# EAGLE design MSXIoT_bus (EAGLE 9.6.2)
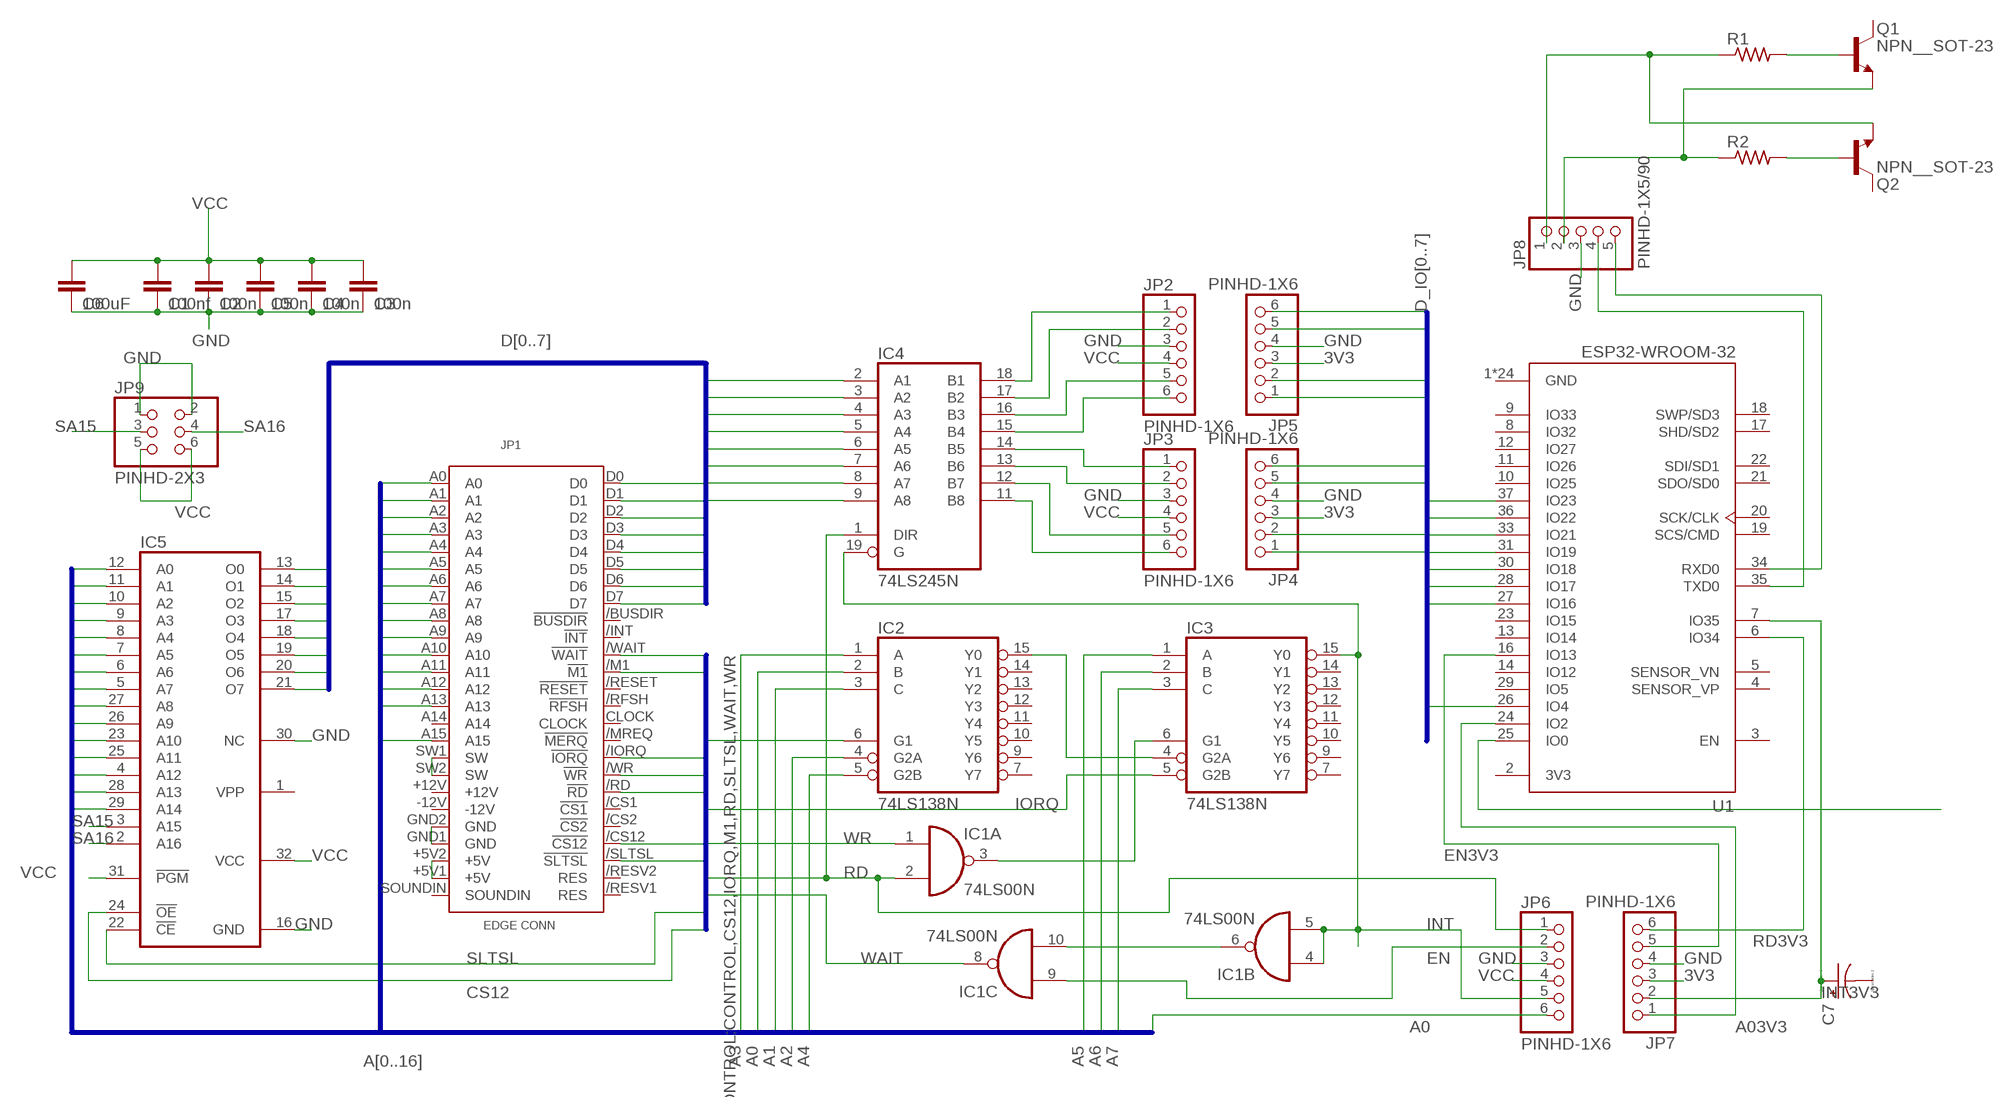
[diagram p0: schematic, sheet 1]

## Parts
C1  100nf  C2.5/2  [C2.5-2]
C2  100n  C2,5-3  [C2.5-3]
C3  100n  C2,5-3  [C2.5-3]
C4  100n  C2,5-3  [C2.5-3]
C5  100n  C2,5-3  [C2.5-3]
C6  100uF  C2.5/6  [C2.5-6]
C7  CPOL-US153CLV-0505  [153CLV-0505]
IC1  74LS00N  [DIL14]
IC2  74LS138N  [DIL16]
IC3  74LS138N  [DIL16]
IC4  74LS245N  [DIL20]
IC5  27C1001A  [DIL32]
JP1  MSXCART  [MSXCART]
JP2  PINHD-1X6  [1X06]
JP3  PINHD-1X6  [1X06]
JP4  PINHD-1X6  [1X06]
JP5  PINHD-1X6  [1X06]
JP6  PINHD-1X6  [1X06]
JP7  PINHD-1X6  [1X06]
JP8  PINHD-1X5/90  [1X05/90]
JP9  PINHD-2X3  [2X03]
Q1  NPN__SOT-23  [SOT95P237X112-3N]
Q2  NPN__SOT-23  [SOT95P237X112-3N]
R1  R-US_0204/5  [0204/5]
R2  R-US_0204/5  [0204/5]
U1  ESP32-WROOM-32  [MODULE_ESP32-WROOM-32]

## Nets
3V3: JP4.3 JP5.3 JP7.3
A0: IC2.2(B) IC5.12(A0) JP1.A0 JP6.6
A1: IC2.3(C) IC5.11(A1) JP1.A1
A2: IC2.4(G2A) IC5.10(A2) JP1.A2
A3: IC2.1(A) IC5.9(A3) JP1.A3
A03V3: JP7.1 U1.24(IO2)
A4: IC2.5(G2B) IC5.8(A4) JP1.A4
A5: IC3.1(A) IC5.7(A5) JP1.A5
A6: IC3.2(B) IC5.6(A6) JP1.A6
A7: IC3.3(C) IC5.5(A7) JP1.A7
A8: IC5.27(A8) JP1.A8
A9: IC5.26(A9) JP1.A9
A10: IC5.23(A10) JP1.A10
A11: IC5.25(A11) JP1.A11
A12: IC5.4(A12) JP1.A12
A13: IC5.28(A13) JP1.A13
A14: IC5.29(A14) JP1.A15
CS12: IC5.24(!OE) JP1./CS12(!CS12)
D0: IC4.2(A1) IC5.13(O0) JP1.D0
D1: IC4.3(A2) IC5.14(O1) JP1.D1
D2: IC4.4(A3) IC5.15(O2) JP1.D2
D3: IC4.5(A4) IC5.17(O3) JP1.D3
D4: IC4.6(A5) IC5.18(O4) JP1.D4
D5: IC4.7(A6) IC5.19(O5) JP1.D5
D6: IC4.8(A7) IC5.20(O6) JP1.D6
D7: IC4.9(A8) IC5.21(O7) JP1.D7
D_IO0: JP5.6 U1.37(IO23)
D_IO1: JP5.5 U1.36(IO22)
D_IO2: JP5.2 U1.33(IO21)
D_IO3: JP5.1 U1.31(IO19)
D_IO4: JP4.6 U1.30(IO18)
D_IO5: JP4.5 U1.28(IO17)
D_IO6: JP4.2 U1.27(IO16)
D_IO7: JP4.1 U1.26(IO4)
EN: IC1.9(C:I0) JP6.2
EN3V3: JP7.5 U1.16(IO13)
GND: C1.2 C2.2 C3.2 C4.2 C5.2 C6.2 IC5.16(GND) IC5.30(NC) JP1.GND1(GND) JP1.GND2(GND) JP2.3 JP3.3 JP4.4 JP5.4 JP6.3 JP7.4 JP8.3 JP9.1 JP9.2
INT: IC1.4(B:I0) IC1.5(B:I1) IC3.15(Y0) IC4.19(G) JP6.5
INT3V3: C7.+ JP7.2 U1.7(IO35)
IORQ: IC3.5(G2B) JP1./IORQ(!IORQ)
M1: IC2.6(G1) JP1./M1(!M1)
N$1: IC1.6(B:O) IC1.10(C:I1)
N$2: IC4.18(B1) JP2.1
N$3: IC2.15(Y0) IC3.4(G2A)
N$4: IC1.3(A:O) IC3.6(G1)
N$5: IC4.17(B2) JP2.2
N$6: IC4.16(B3) JP2.5
N$7: IC4.15(B4) JP2.6
N$8: IC4.14(B5) JP3.1
N$9: IC4.13(B6) JP3.2
N$10: IC4.12(B7) JP3.5
N$11: IC4.11(B8) JP3.6
N$12: JP1.SW1(SW) JP1.SW2(SW)
N$13: JP8.4 U1.35(TXD0)
N$14: JP8.5 U1.34(RXD0)
N$15: U1.25(IO0)
N$16: JP8.1 Q2.1(E) R1.1
N$17: Q1.2(B) R1.2
N$18: Q2.2(B) R2.2
N$19: JP8.2 Q1.1(E) R2.1
RD: IC1.2(A:I1) IC4.1(DIR) JP1./RD(!RD) JP6.1
RD3V3: JP7.6 U1.6(IO34)
SA15: IC5.3(A15) JP9.3
SA16: IC5.2(A16) JP9.4
SLTSL: IC5.22(!CE) JP1./SLTSL(!SLTSL)
VCC: C1.1 C2.1 C3.1 C4.1 C5.1 C6.1 IC5.31(!PGM) IC5.32(VCC) JP1.+5V1(+5V) JP1.+5V2(+5V) JP2.4 JP3.4 JP6.4 JP9.5 JP9.6
WAIT: IC1.8(C:O) JP1./WAIT(!WAIT)
WR: IC1.1(A:I0) JP1./WR(!WR)
Unconnected: C7.- IC1.11(D:O) IC1.12(D:I0) IC1.13(D:I1) IC2.7(Y7) IC2.9(Y6) IC2.10(Y5) IC2.11(Y4) IC2.12(Y3) IC2.13(Y2) IC2.14(Y1) IC3.7(Y7) IC3.9(Y6) IC3.10(Y5) IC3.11(Y4) IC3.12(Y3) IC3.13(Y2) IC3.14(Y1) IC5.1(VPP) JP1.+12V JP1.-12V JP1./BUSDIR(!BUSDIR) JP1./CS1(!CS1) JP1./CS2(!CS2) JP1./INT(!INT) JP1./MREQ(!MERQ) JP1./RESET(!RESET) JP1./RESV1(RES) JP1./RESV2(RES) JP1./RFSH(!RFSH) JP1.A14 JP1.CLOCK JP1.SOUNDIN Q1.3(C) Q2.3(C) U1.3(EN) U1.4(SENSOR_VP) U1.5(SENSOR_VN) U1.8(IO32) U1.9(IO33) U1.10(IO25) U1.11(IO26) U1.12(IO27) U1.13(IO14) U1.14(IO12) U1.17(SHD/SD2) U1.18(SWP/SD3) U1.19(SCS/CMD) U1.20(SCK/CLK) U1.21(SDO/SD0) U1.22(SDI/SD1) U1.23(IO15) U1.29(IO5)

## Buses
D[0..7]
A[0..16]
CONTROL:CONTROL,CS12,IORQ,M1,RD,SLTSL,WAIT,WR
D_IO[0..7]

## Power pins joined to a net without a drawn wire
3V3: U1.2(3V3)
GND: IC1.7(P:GND) IC2.8(GND) IC3.8(GND) IC4.10(GND) U1.1(GND) U1.15(GND) U1.38(GND) U1.39_1(GND) U1.39_2(GND) U1.39_3(GND) U1.39_4(GND) U1.39_5(GND) U1.39_6(GND) U1.39_7(GND) U1.39_8(GND) U1.39_9(GND) U1.39_10(GND) U1.39_11(GND) U1.39_12(GND) U1.39_13(GND) U1.39_14(GND) U1.39_15(GND) U1.39_16(GND) U1.39_17(GND) U1.39_18(GND) U1.39_19(GND) U1.39_20(GND) U1.39_21(GND)
VCC: IC1.14(P:VCC) IC2.16(VCC) IC3.16(VCC) IC4.20(VCC)

## Library data of the parts
C1-C6 = capacitor-wima:C: CAPACITOR naming: grid - package width
C7 = resistor:CPOL-US: POLARIZED CAPACITOR, American symbol
IC1 = 74xx-eu:74*00: Quad 2-input NAND gate
IC2 IC3 = 74xx-eu:74*138: 3-line to 8-line DECODER/DEMULTIPLEXER
IC4 = 74xx-us:74*245: Octal BUS TRANSCEIVER, 3-state
IC5 = memory-nec:27C1001A: MEMORY; MPN: M27C1001-15F1; OC_FARNELL: 1661756; OC_NEWARK: 78M7615
JP1 = msx-con:MSXCART
JP2-JP7 = Connector:PINHD-1X6: PIN HEADER; CATEGORY: CONNECTOR; SUB-CATEGORY: PIN-HEADER
JP8 = Connector:PINHD-1X5: PIN HEADER; CATEGORY: CONNECTOR; SUB-CATEGORY: PIN-HEADER
JP9 = Connector:PINHD-2X3: PIN HEADER; CATEGORY: CONNECTOR; SUB-CATEGORY: PIN-HEADER
Q1 Q2 = Transistor:NPN_: NPN - Popular parts; CATEGORY: Transistor; DESCRIPTION: TRANS NPN 40V 0.2A SOT23; MANUFACTURER: Nexperia USA Inc.; SUB-CATEGORY: BJT; TYPE: NPN
R1 R2 = resistor:R-US_: RESISTOR, American symbol
U1 = ESP32-WROOM-32:ESP32-WROOM-32: Bluetooth, WiFi Transceiver Module 2.4GHz ~ 2.5GHz Surface Mount; AVAILABILITY: Unavailable; DESCRIPTION: 802.11b/g/n, Bluetooth v4.2 +EDR, Class 1, 2 and 3 Transceiver Module 2.4GHz ~ 2.5GHz Integrated, Trace Surface Mount; MF: Espressif Systems; MP: ESP32-WROOM-32; PACKAGE: Module Espressif Systems; PRICE: None

## Board
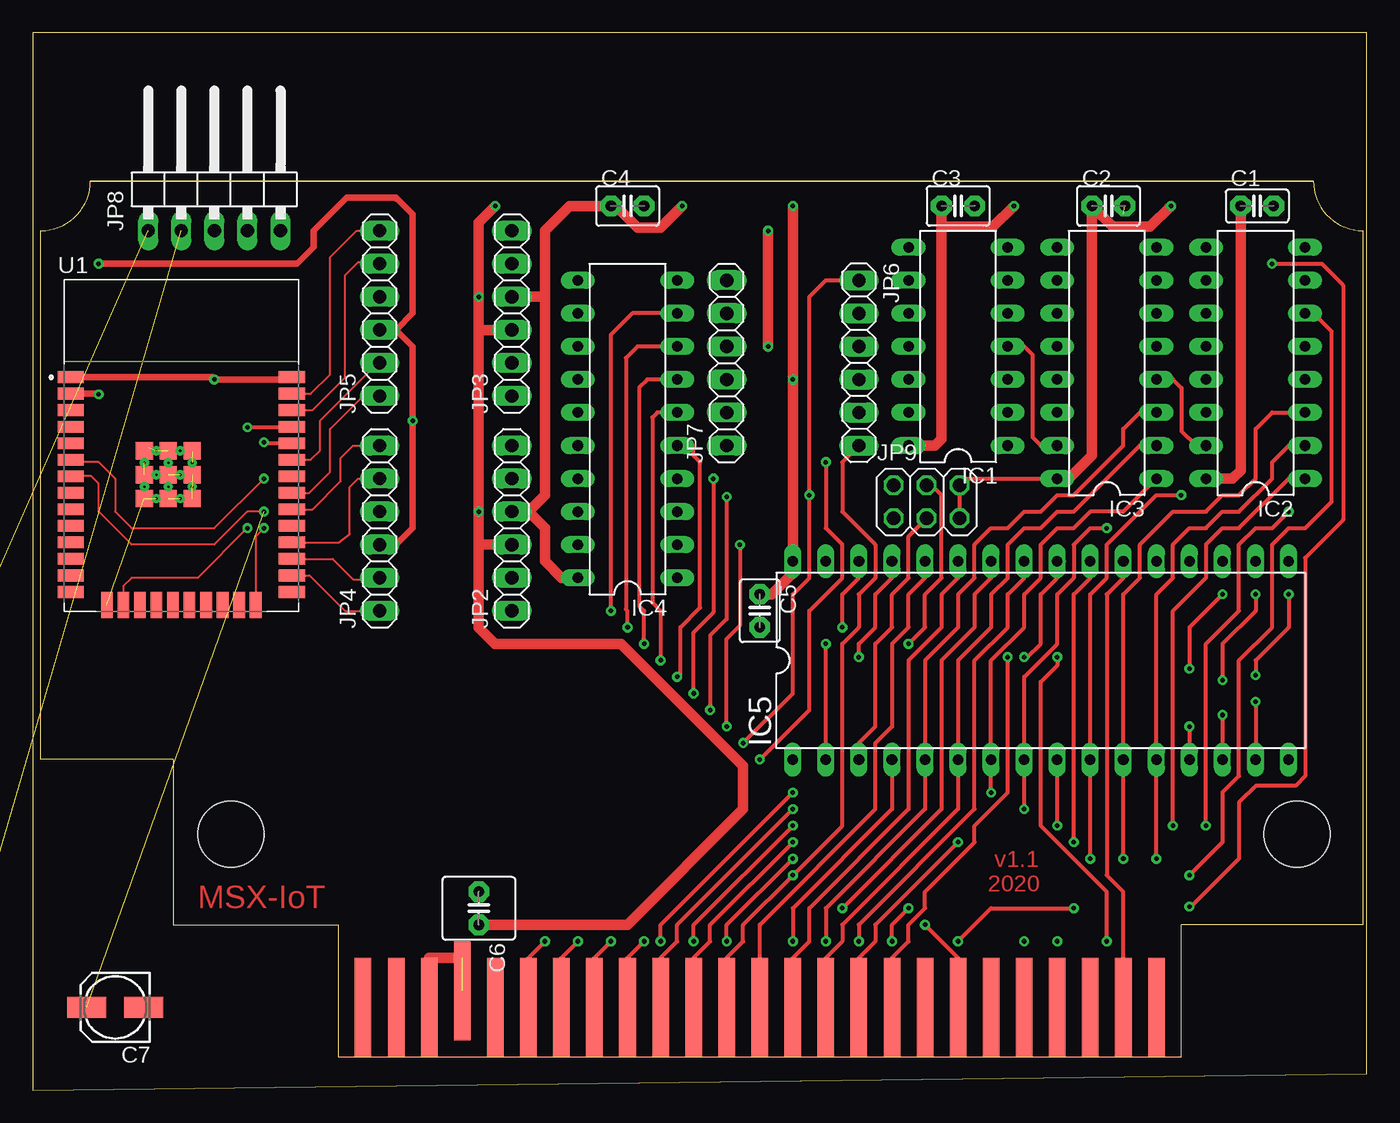
[diagram p1: board, top side]
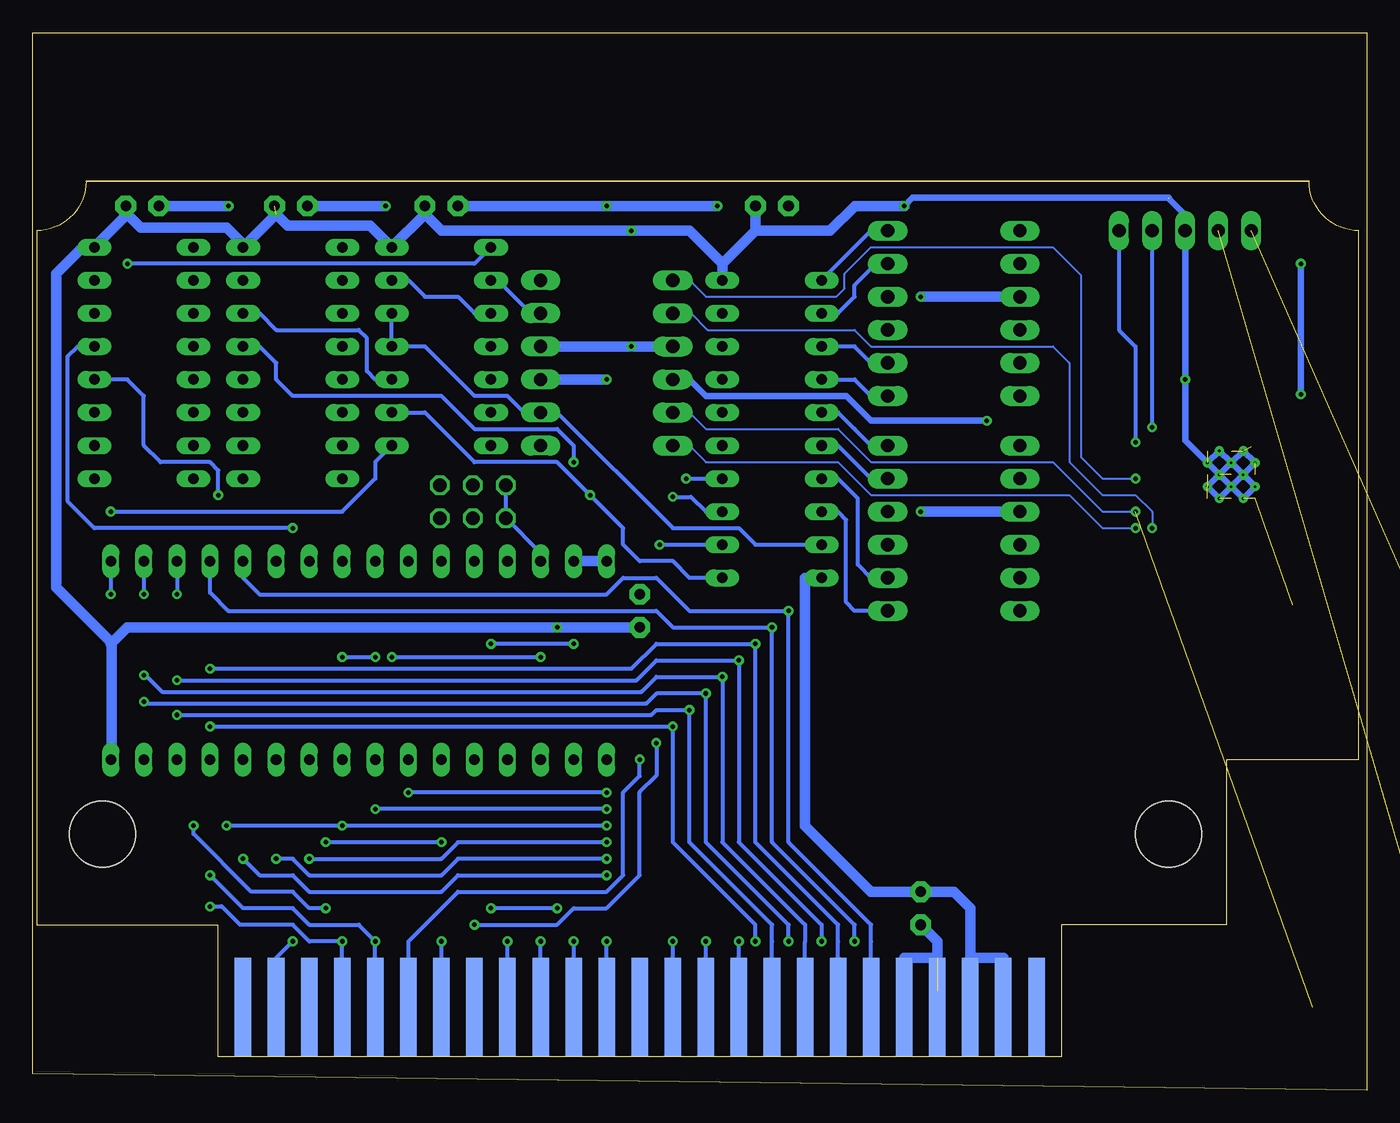
[diagram p2: board, bottom side, seen from below]

Size 102.54 x 81.27 mm. Coordinates in mm from the lower left corner, seen from the top.
Outline: 0,0 102.54,1.27 102.54,81.27 0,81.27 0,0
Copper layers (1*16): Top 0.035mm / dielectric 1.5mm / Bottom 0.035mm
Design rules "default": minimum track width 6mil, minimum drill 0.35mm, track to track 6mil, track to pad 6mil, pad to pad 6mil, via to via 6mil, smd to smd 6mil, copper to edge 40mil, drill to drill 6mil, minimum pad ring 10mil, minimum via ring 8mil, stop-mask expansion 4mil, vias tented up to drill 0mil, thermal gap 10mil

### Footprints (pad centres in the part's own frame; a part is rotated, then mirrored left to right if it is on the bottom)
C2.5-2 = drill 0.813 pad 1.6 octagon: 1 -1.27,0; 2 1.27,0
C2.5-3 = drill 0.813 pad 1.6 octagon: 1 -1.27,0; 2 1.27,0
C2.5-6 = drill 0.813 pad 1.6 octagon: 1 -1.27,0; 2 1.27,0
153CLV-0505 = smd 3 x 1.6: + 2.2,0; - -2.2,0
DIL14 = drill 0.813 long: 1 -7.62,-3.81; 2 -5.08,-3.81; 3 -2.54,-3.81; 4 0,-3.81; 5 2.54,-3.81; 6 5.08,-3.81; 7 7.62,-3.81; 8 7.62,3.81; 9 5.08,3.81; 10 2.54,3.81; 11 0,3.81; 12 -2.54,3.81; 13 -5.08,3.81; 14 -7.62,3.81
DIL16 = drill 0.813 long: 1 -8.89,-3.81; 2 -6.35,-3.81; 3 -3.81,-3.81; 4 -1.27,-3.81; 5 1.27,-3.81; 6 3.81,-3.81; 7 6.35,-3.81; 8 8.89,-3.81; 9 8.89,3.81; 10 6.35,3.81; 11 3.81,3.81; 12 1.27,3.81; 13 -1.27,3.81; 14 -3.81,3.81; 15 -6.35,3.81; 16 -8.89,3.81
DIL20 = drill 0.813 long: 1 -11.43,-3.81; 2 -8.89,-3.81; 3 -6.35,-3.81; 4 -3.81,-3.81; 5 -1.27,-3.81; 6 1.27,-3.81; 7 3.81,-3.81; 8 6.35,-3.81; 9 8.89,-3.81; 10 11.43,-3.81; 11 11.43,3.81; 12 8.89,3.81; 13 6.35,3.81; 14 3.81,3.81; 15 1.27,3.81; 16 -1.27,3.81; 17 -3.81,3.81; 18 -6.35,3.81; 19 -8.89,3.81; 20 -11.43,3.81
DIL32 = drill 0.813 long: 1 -19.05,-7.62; 2 -16.51,-7.62; 3 -13.97,-7.62; 4 -11.43,-7.62; 5 -8.89,-7.62; 6 -6.35,-7.62; 7 -3.81,-7.62; 8 -1.27,-7.62; 9 1.27,-7.62; 10 3.81,-7.62; 11 6.35,-7.62; 12 8.89,-7.62; 13 11.43,-7.62; 14 13.97,-7.62; 15 16.51,-7.62; 16 19.05,-7.62; 17 19.05,7.62; 18 16.51,7.62; 19 13.97,7.62; 20 11.43,7.62; 21 8.89,7.62; 22 6.35,7.62; 23 3.81,7.62; 24 1.27,7.62; 25 -1.27,7.62; 26 -3.81,7.62; 27 -6.35,7.62; 28 -8.89,7.62; 29 -11.43,7.62; 30 -13.97,7.62; 31 -16.51,7.62; 32 -19.05,7.62
MSXCART = smd 1.27 x 7.62 bottom: +5V1 -24.13,-36.83; +5V2 -21.59,-36.83; /CS1 34.29,-36.83; /CS12 31.75,-36.83; /IORQ 21.59,-36.83; /M1 24.13,-36.83; /RESET 16.51,-36.83; /RESV2 29.21,-36.83; /WAIT 26.67,-36.83; /WR 19.05,-36.83; A1 1.27,-36.83; A3 -1.27,-36.83; A5 -3.81,-36.83; A7 8.89,-36.83; A9 13.97,-36.83; A11 11.43,-36.83; A12 6.35,-36.83; A14 3.81,-36.83; D1 -6.35,-36.83; D3 -8.89,-36.83; D5 -11.43,-36.83; D7 -13.97,-36.83; GND1 -19.05,-36.83; GND2 -16.51,-36.83; SOUNDIN -26.67,-36.83 | smd 1.27 x 7.62: +12V -24.13,-36.83; -12V -26.67,-36.83; /BUSDIR 24.13,-36.83; /CS2 34.29,-36.83; /INT 26.67,-36.83; /MREQ 21.59,-36.83; /RD 19.05,-36.83; /RESV1 16.51,-36.83; /RFSH 29.21,-36.83; /SLTSL 31.75,-36.83; A0 1.27,-36.83; A2 -1.27,-36.83; A4 -3.81,-36.83; A6 8.89,-36.83; A8 6.35,-36.83; A10 11.43,-36.83; A13 3.81,-36.83; A15 13.97,-36.83; CLOCK -16.51,-36.83; D0 -6.35,-36.83; D2 -8.89,-36.83; D4 -11.43,-36.83; D6 -13.97,-36.83; SW1 -19.05,-35.56; SW2 -21.59,-36.83 | hole 5.08: -36.83,-23.495; 45.085,-23.495
1X06 = drill 1.016 long: 1 -6.35,0; 2 -3.81,0; 3 -1.27,0; 4 1.27,0; 5 3.81,0; 6 6.35,0
1X05/90 = drill 1.016 long: 1 -5.08,-3.81; 2 -2.54,-3.81; 3 0,-3.81; 4 2.54,-3.81; 5 5.08,-3.81
2X03 = drill 1.016 octagon: 1 -2.54,-1.27; 2 -2.54,1.27; 3 0,-1.27; 4 0,1.27; 5 2.54,-1.27; 6 2.54,1.27
SOT95P237X112-3N = smd 1.224 x 0.625: 1 -1.064,0.95; 2 -1.064,-0.95; 3 1.064,0
0204/5 = drill 0.813 octagon: 1 -2.54,0; 2 2.54,0
MODULE_ESP32-WROOM-32 = smd 2 x 0.9: 1 -8.5,5.26; 2 -8.5,3.99; 3 -8.5,2.72; 4 -8.5,1.45; 5 -8.5,0.18; 6 -8.5,-1.09; 7 -8.5,-2.36; 8 -8.5,-3.63; 9 -8.5,-4.9; 10 -8.5,-6.17; 11 -8.5,-7.44; 12 -8.5,-8.71; 13 -8.5,-9.98; 14 -8.5,-11.25; 25 8.5,-11.25; 26 8.5,-9.98; 27 8.5,-8.71; 28 8.5,-7.44; 29 8.5,-6.17; 30 8.5,-4.9; 31 8.5,-3.63; 32 8.5,-2.36; 33 8.5,-1.09; 34 8.5,0.18; 35 8.5,1.45; 36 8.5,2.72; 37 8.5,3.99; 38 8.5,5.26 | smd 0.9 x 2: 15 -5.715,-12.25; 16 -4.445,-12.25; 17 -3.175,-12.25; 18 -1.905,-12.25; 19 -0.635,-12.25; 20 0.635,-12.25; 21 1.905,-12.25; 22 3.175,-12.25; 23 4.445,-12.25; 24 5.715,-12.25 | smd 1.33 x 1.33: 39_1 -2.835,-0.405; 39_2 -1,-0.405; 39_3 0.835,-0.405; 39_4 -2.835,-2.24; 39_5 -1,-2.24; 39_6 0.835,-2.24; 39_7 -2.835,-4.075; 39_8 -1,-4.075; 39_9 0.835,-4.075 | drill 0.2 pad 0.3: 39_10 -1.917,-0.405; 39_11 -0.083,-0.405; 39_12 -2.835,-1.323; 39_13 -1,-1.323; 39_14 0.835,-1.323; 39_15 -1.917,-2.24; 39_16 -0.083,-2.24; 39_17 -2.835,-3.158; 39_18 -1,-3.158; 39_19 0.835,-3.158; 39_20 -1.917,-4.075; 39_21 -0.083,-4.075

### Placement (x,y rotation side)
C1  94.11,67.94 0 top
C2  82.68,67.94 0 top
C3  71.12,67.94 0 top
C4  45.72,67.94 0 top
C5  55.88,36.83 270 top
C6  34.29,13.97 270 top
C7  6.35,6.35 180 top
IC1  71.12,57.15 90 top
IC2  93.98,55.88 90 top
IC3  82.55,55.88 90 top
IC4  45.72,50.8 90 top
IC5  77.47,33.02 0 top
JP1  52.07,43.18 0 top
JP2  36.83,43.18 90 top
JP3  36.83,59.69 90 top
JP4  26.67,43.18 90 top
JP5  26.67,59.69 90 top
JP6  63.5,55.88 270 top
JP7  53.34,55.88 90 top
JP8  13.97,69.85 0 top
JP9  68.71,45.21 0 top
Q1  -5.08,5.08 0 top  (outside the outline)
Q2  -16.51,5.08 0 top  (outside the outline)
R1  -19.05,-3.81 0 top  (outside the outline)
R2  -19.05,-7.62 0 top  (outside the outline)
U1  11.43,49.53 0 top

### Tracks (layer width: path | path; a pad name or v marks a point on that pad's centre or on a via)
3V3  (via drill 0.35)
  Top 0.508: JP4.3 27.94,41.91 29.21,43.18 v29.21,51.44 29.21,57.15 27.94,58.42 | JP5.3 27.94,58.42 | 27.94,58.42 29.21,59.69 29.21,67.31 28,68.52 | 28,68.52 27.94,68.52 | 28,68.52 27.94,68.58 24.13,68.58 21.59,66.04 21.59,64.77 20.32,63.5 v5.08,63.5 | v5.08,53.47 5.03,53.52 U1.2
  Bottom 0.508: JP7.3 52.07,54.61 50.8,53.34 40.01,53.34 38.1,51.44 v29.21,51.44 | v5.08,63.5 v5.08,53.47
A0  (via drill 0.35)
  Top 0.305: JP1.A0 53.34,10.16 54.61,11.43 54.61,12.7 v58.42,16.51 62.23,20.32 62.23,34.29 63.5,35.56 63.5,38.1 64.77,39.37 64.77,41.91 62.23,44.45 62.23,48.26 JP6.6 | v86.36,17.78 IC5.12 86.36,38.1 87.63,39.37 87.63,41.91 88.9,43.18 90.17,43.18 91.44,44.45 92.71,44.45 95.25,46.99 95.25,48.26 96.52,49.53 IC2.2
  Bottom 0.305: v86.36,17.78 85.09,16.51 82.55,16.51 81.28,15.24 71.12,15.24 69.85,16.51 v58.42,16.51
A1  (via drill 0.35)
  Top 0.305: v53.34,11.43 53.34,12.7 v58.42,17.78 | v83.82,17.78 IC5.11 | IC5.11 83.95,25.53 | IC5.11 83.82,38.1 85.09,39.37 85.09,41.91 87.63,44.45 90.17,44.45 91.44,45.72 92.71,45.72 93.98,46.99 93.98,50.8 95.25,52.07 IC2.3
  Bottom 0.305: JP1.A1 v53.34,11.43 | v83.82,17.78 82.55,17.78 81.28,16.51 71.12,16.51 69.85,17.78 v58.42,17.78
A2  (via drill 0.35)
  Top 0.305: JP1.A2 50.8,10.16 52.07,11.43 52.07,12.7 v58.42,19.05 | v81.28,17.78 IC5.10 81.28,38.1 82.55,39.37 82.55,41.91 86.36,45.72 v88.27,45.72
  Bottom 0.305: v58.42,19.05 69.85,19.05 71.12,17.78 v81.28,17.78 | v88.27,45.72 88.27,47.62 88.9,48.26 92.71,48.26 93.98,49.53 93.98,53.34 95.25,54.61 IC2.4
A3  (via drill 0.35)
  Top 0.305: v50.8,11.43 50.8,12.7 v58.42,20.32 | v78.74,20.32 IC5.9 | v87.63,20.32 87.63,36.83 90.17,39.37 90.17,41.91 91.44,43.18 92.71,43.18 96.52,46.99 IC2.1
  Bottom 0.305: JP1.A3 v50.8,11.43 | v58.42,20.32 v78.74,20.32 v87.63,20.32
A03V3  (via drill 0.35)
  Top 0.152: v17.78,43.18 17.14,42.55 U1.24
  Bottom 0.152: JP7.1 52.07,49.53 50.8,48.26 40.64,48.26 38.1,45.72 22.86,45.72 20.32,43.18 v17.78,43.18
A4  (via drill 0.35)
  Top 0.305: JP1.A4 48.26,10.16 49.53,11.43 49.53,12.7 v58.42,21.59 | v76.2,21.59 IC5.8 76.2,31.75 78.74,34.29 78.74,38.1 80.01,39.37 80.01,41.91 81.28,43.18 v82.55,43.18
  Bottom 0.305: v58.42,21.59 v76.2,21.59 | v82.55,43.18 97.79,43.18 99.82,45.21 99.82,56.39 99.06,57.15 IC2.5
A5  (via drill 0.35)
  Top 0.305: v48.26,11.43 48.26,12.7 v58.42,22.86 | v73.66,22.86 IC5.7 73.66,33.02 76.2,35.56 76.2,38.1 77.47,39.37 77.47,41.91 78.74,43.18 80.01,43.18 81.28,44.45 83.82,44.45 IC3.1
  Bottom 0.305: JP1.A5 v48.26,11.43 | v58.42,22.86 v73.66,22.86
A6
  Top 0.305: JP1.A6 60.96,10.16 62.23,11.43 62.23,12.7 71.12,21.59 IC5.6 71.12,33.02 73.66,35.56 73.66,38.1 74.93,39.37 74.93,41.91 76.2,43.18 77.47,43.18 78.74,44.45 80.01,44.45 85.09,49.53 IC3.2
A7  (via drill 0.35)
  Top 0.305: v60.96,11.43 60.96,13.97 68.58,21.59 IC5.5 68.58,33.02 71.12,35.56 71.12,38.1 72.39,39.37 72.39,41.91 73.66,43.18 74.93,43.18 76.2,44.45 77.47,44.45 78.74,45.72 80.01,45.72 83.82,49.53 83.82,50.8 85.09,52.07 IC3.3
  Bottom 0.305: v60.96,11.43 JP1.A7
A8
  Top 0.305: 70.61,40.64 IC5.27 71.12,39.37 69.85,38.1 69.85,35.56 67.31,33.02 67.31,21.59 59.69,13.97 59.69,11.43 58.42,10.16 JP1.A8
A9  (via drill 0.35)
  Top 0.305: v67.31,13.97 66.04,12.7 v66.04,11.43 | IC5.26 73.66,39.37 72.39,38.1 72.39,35.56 69.85,33.02 69.85,21.59 v62.23,13.97
  Bottom 0.305: JP1.A9 v66.04,11.43 | v62.23,13.97 v67.31,13.97
A10  (via drill 0.35)
  Top 0.305: JP1.A10 63.5,10.16 64.77,11.43 64.77,12.7 v71.12,19.05 | IC5.23 81.28,39.37 80.01,38.1 v80.01,19.05
  Bottom 0.305: v71.12,19.05 v80.01,19.05
A11  (via drill 0.35)
  Top 0.305: v63.5,11.43 63.5,12.7 72.39,21.59 72.39,33.02 74.93,35.56 74.93,38.1 76.2,39.37 IC5.25
  Bottom 0.305: JP1.A11 v63.5,11.43
A12  (via drill 0.35)
  Top 0.305: IC5.4 66.04,21.59 58.42,13.97 v58.42,11.43
  Bottom 0.305: JP1.A12 v58.42,11.43
A13
  Top 0.305: JP1.A13 55.88,12.7 64.77,21.59 64.77,26.67 66.04,27.94 66.04,34.29 67.31,35.56 67.31,38.1 68.58,39.37 IC5.28
A14  (via drill 0.35)
  Top 0.305: JP1.A15 66.04,10.16 67.31,11.43 67.31,12.7 68.58,13.97 68.58,15.24 72.39,19.05 72.39,20.32 74.93,22.86 v74.93,33.27 | IC5.29 66.04,39.37 64.77,38.1 64.77,35.56 63.5,34.29 v63.5,33.27
  Bottom 0.305: v74.93,33.27 v63.5,33.27
CS12  (via drill 0.35)
  Top 0.305: 79.26,40.64 IC5.24 78.74,39.37 77.47,38.1 77.47,34.29 76.45,33.27 v76.2,33.27 | v78.74,33.27 78.74,32.64 77.47,31.37 77.47,20.32 82.55,15.24 v82.55,11.43
  Bottom 0.305: v82.55,11.43 83.82,10.16 JP1./CS12 | v78.74,33.27 v76.2,33.27
D0  (via drill 0.35)
  Top 0.305: JP1.D0 45.72,10.16 v46.99,11.43 | v88.9,27.94 IC5.13 | v53.34,27.94 53.34,34.67 54.36,35.69 v54.36,41.91
  Bottom 0.305: v88.9,27.94 v53.34,27.94 53.34,19.05 46.99,12.7 v46.99,11.43 | v54.36,41.91 IC4.2
D1  (via drill 0.35)
  Top 0.305: v91.44,28.83 IC5.14 | v52.07,29.21 52.07,34.93 53.34,36.2 v53.34,45.59
  Bottom 0.305: v91.44,28.83 54.99,28.83 54.61,29.21 v52.07,29.21 52.07,19.05 45.72,12.7 45.72,11.43 JP1.D1 | v53.34,45.59 51.94,45.59 50.8,44.45 IC4.3
D2  (via drill 0.35)
  Top 0.305: v93.98,29.84 IC5.15 | JP1.D2 43.18,10.16 v44.45,11.43 | v50.8,30.48 50.8,35.18 52.32,36.7 v52.32,46.99
  Bottom 0.305: v93.98,29.84 93.85,29.72 55.37,29.72 54.61,30.48 v50.8,30.48 50.8,19.05 44.45,12.7 v44.45,11.43 | v52.32,46.99 IC4.4
D3  (via drill 0.35)
  Top 0.305: v96.52,38.1 96.52,35.56 93.98,33.02 v93.98,31.88 93.98,31.75 | v49.53,31.75 49.78,32 49.78,35.56 51.31,37.08 51.31,48.26 50.8,48.77 50.8,49.53 IC4.5
  Bottom 0.305: v93.98,31.88 93.85,31.88 92.58,30.61 55.75,30.61 54.61,31.75 v49.53,31.75 49.53,19.05 43.18,12.7 43.18,11.43 JP1.D3 | IC5.17 v96.52,38.1
D4  (via drill 0.35)
  Top 0.305: JP1.D4 40.64,10.16 v41.91,11.43 | v93.98,38.1 93.98,36.83 91.44,34.29 v91.44,31.5 | v48.26,33.02 48.26,36.83 47.62,37.47 47.62,51.69 48.01,52.07 IC4.6
  Bottom 0.305: v48.26,33.02 48.39,33.15 | IC5.18 v93.98,38.1 | v48.26,33.02 54.61,33.02 56.13,31.5 v91.44,31.5 | v48.26,33.02 48.26,19.05 41.91,12.7 v41.91,11.43
D5  (via drill 0.35)
  Top 0.305: v91.44,38.1 88.9,35.56 v88.9,32.38 | v46.99,34.29 46.99,36.83 46.61,37.21 46.61,53.98 47.24,54.61 IC4.7
  Bottom 0.305: IC5.19 v91.44,38.1 | 40.64,10.16 JP1.D5 40.64,11.43 40.64,12.7 46.99,19.05 v46.99,34.29 54.61,34.29 56.52,32.38 v88.9,32.38
D6  (via drill 0.35)
  Top 0.305: JP1.D6 38.1,10.16 v39.37,11.43 | IC4.8 46.48,57.15 45.59,56.26 45.59,36.96 45.72,36.83 v45.72,35.56
  Bottom 0.305: IC5.20 88.9,38.23 87.5,36.83 54.61,36.83 53.34,35.56 v45.72,35.56 45.72,19.05 39.37,12.7 v39.37,11.43
D7  (via drill 0.35)
  Top 0.305: IC4.9 46.1,59.69 44.45,58.04 v44.45,36.83
  Bottom 0.305: JP1.D7 38.1,11.43 38.1,12.7 44.45,19.05 v44.45,36.83 52.07,36.83 54.61,39.37 57.15,39.37 58.42,38.1 85.09,38.1 86.36,39.37 IC5.21
D_IO0
  Top 0.152: U1.37 21.39,53.52 22.86,54.99 22.86,64.01 24.89,66.04 JP5.6
D_IO1
  Top 0.152: U1.36 21.52,52.25 24,54.74 24,62.61 25.02,63.63 26.54,63.63 JP5.5
D_IO2
  Top 0.152: 19.97,48.4 U1.33 21.39,48.44 22.1,49.15 22.1,51.44 26.42,55.75 26.54,55.75 JP5.2
D_IO3
  Top 0.152: 20.11,45.72 U1.31 21.26,45.9 22.86,47.5 22.86,50.8 25.4,53.34 JP5.1
D_IO4
  Top 0.152: U1.30 21.52,44.63 23.68,46.8 23.68,48.58 24.64,49.53 JP4.6
D_IO5
  Top 0.152: U1.28 23.53,42.09 24.38,42.73 24.38,46.36 25.02,46.99 JP4.5
D_IO6
  Top 0.152: U1.27 23.06,40.82 24.64,39.24 26.54,39.24 JP4.2
D_IO7
  Top 0.152: JP4.1 24,36.83 21.28,39.55 U1.26
EN
  Bottom 0.305: JP6.2 64.26,59.69 66.8,62.23 IC1.9
EN3V3  (via drill 0.35)
  Top 0.152: U1.16 6.99,38.74 7.62,39.37 12.7,39.37 v16.51,43.18
  Bottom 0.152: JP7.5 51.94,59.69 50.67,58.42 39.37,58.42 38.1,57.15 24.13,57.15 22.86,55.88 22.86,48.26 20.32,45.72 17.78,45.72 16.51,44.45 v16.51,43.18
GND  (via drill 0.35)  (12 unrouted)
  Top 0.305: 8.89,49.42 U1.39_1 | IC5.30 63.5,39.37 62.23,38.1 v62.23,35.56
  Top 0.508: U1.1 13.79,54.79 v13.97,54.61 19.75,54.61 U1.38
  Top 0.813: 34.29,41.91 34.29,35.56 35.56,34.29 45.21,34.29 54.61,24.89 54.61,21.59 45.72,12.7 C6.2 | 34.29,41.91 v34.29,44.45 34.29,58.42 | 34.29,58.42 v34.29,60.96 34.29,66.67 v35.56,67.94 | JP2.3 34.29,41.91 | JP3.3 34.29,58.42 | v56.52,66.04 v56.52,57.15
  Bottom 0.305: IC5.30 63.5,41.28 JP9.1 JP9.2
  Bottom 0.508: 15.24,68.52 13.97,67.25 JP8.3 v13.97,54.61 13.97,49.91 U1.39_14 | 15.24,68.58 34.92,68.58 v35.56,67.94 | 13.59,49.53 U1.39_14 | U1.39_14 U1.39_11 U1.39_13 | U1.39_13 U1.39_10 U1.39_12 U1.39_15 | U1.39_15 U1.39_13 | U1.39_13 U1.39_16 | U1.39_16 U1.39_19 U1.39_21 U1.39_18 | U1.39_18 U1.39_20 U1.39_17 U1.39_15 | U1.39_15 U1.39_18 | U1.39_18 U1.39_16 | U1.39_16 U1.39_14
  Bottom 0.813: 33.25,8.42 33.25,6.58 JP1.GND1 33.02,10.16 | 35.33,8.42 35.33,6.58 JP1.GND2 35.56,10.16 33.02,10.16 | C5.2 v62.23,35.56 95.25,35.56 96.46,34.35 | 96.46,34.35 96.52,34.29 | 96.46,34.35 100.71,38.61 100.71,62.74 98.68,64.77 IC2.8 95.38,67.18 95.38,67.44 | 72.39,67.31 IC1.7 76.58,66.42 82.93,66.42 83.82,67.31 | 72.39,67.31 C3.2 | 49.53,63.5 52.07,66.04 v56.52,66.04 71.12,66.04 72.39,67.31 | v35.56,67.94 39.35,67.94 41.26,66.04 46.99,66.04 | C6.2 33.02,11.43 33.02,10.16 | JP5.4 v34.29,60.96 | JP4.4 v34.29,44.45 | C2.2 83.95,67.18 IC3.8 86.36,65.02 87.63,66.29 94.23,66.29 95.38,67.44 | C1.2 95.38,67.44 | 46.99,66.04 C4.2 | IC4.10 49.53,63.5 | 49.53,63.5 46.99,66.04 | JP7.4 v56.52,57.15 JP6.3 | IC5.16 96.46,25.46 96.46,34.35
INT
  Top 0.305: IC1.4 76.2,57.15 76.84,56.52 76.84,50.17 77.47,49.53 IC3.15
  Bottom 0.305: IC1.5 IC1.4 72.39,57.15 68.58,53.34 66.04,53.34 64.77,52.07 JP6.5 62.23,52.07 53.34,43.18 48.26,43.18 46.99,41.91 IC4.19
INT3V3  (via drill 0.35)  (1 unrouted)
  Top 0.152: v17.78,44.45 16.51,44.45 13.97,41.91 7.62,41.91 5.08,44.45 5.08,46.61 4.52,47.17 U1.7
  Bottom 0.152: JP7.2 52.07,52.07 50.8,50.8 40.64,50.8 38.1,48.26 24.13,48.26 20.32,44.45 v17.78,44.45
IORQ  (via drill 0.35)
  Top 0.305: v55.88,25.4 59.69,29.21 59.69,36.83 62.23,39.37 62.23,41.91 60.96,43.18 v60.96,48.26
  Bottom 0.305: JP1./IORQ 73.66,11.43 69.85,15.24 58.42,15.24 57.15,16.51 57.15,22.86 55.88,24.13 v55.88,25.4 | IC3.5 85.09,57.15 83.82,55.88 83.82,54.61 82.55,53.34 71.12,53.34 68.58,50.8 62.23,50.8 60.96,49.53 v60.96,48.26
M1  (via drill 0.35)
  Top 0.305: v88.9,16.51 91.44,19.05 91.44,22.86 92.71,24.13 92.71,33.02 95.25,35.56 95.25,41.91 96.52,43.18 97.79,43.18 99.82,45.21 99.82,58.29 98.43,59.69 IC2.6
  Bottom 0.305: JP1./M1 v76.2,11.43 77.47,12.7 81.28,12.7 82.55,13.97 86.35,13.97 88.89,16.51 v88.9,16.51
N$1
  Bottom 0.305: IC1.10 68.58,59.69 69.85,60.96 72.39,60.96 73.66,62.23 IC1.6
N$2
  Bottom 0.305: JP2.1 39.37,36.83 40.03,37.49 40.03,43.82 40.66,44.45 IC4.18
N$3
  Top 0.305: IC3.4 87.63,54.61 88.29,53.95 88.29,50.65 89.42,49.53 IC2.15
N$4
  Bottom 0.305: IC1.3 76.2,54.61 76.84,55.25 76.84,57.79 77.47,58.42 83.82,58.42 85.09,59.69 IC3.6
N$5
  Bottom 0.305: JP2.2 38.1,39.37 39.12,40.39 39.12,45.47 40.64,46.99 IC4.17
N$6
  Bottom 0.305: JP2.5 38.1,46.99 40.64,49.53 IC4.16
N$7
  Bottom 0.305: JP2.6 38.1,49.53 39.37,50.8 40.64,52.07 IC4.15
N$8
  Bottom 0.305: IC4.14 39.37,54.61 38.1,53.34 JP3.1
N$9
  Bottom 0.305: IC4.13 39.37,57.15 38.1,55.88 JP3.2
N$10
  Bottom 0.305: JP3.5 37.72,63.5 39.37,61.85 39.37,60.96 40.64,59.69 IC4.12
N$11
  Bottom 0.305: JP3.6 38.1,66.04 IC4.11
N$12  (1 unrouted)
  Top 0.813: JP1.SW2 30.48,10.16 33.02,10.16
N$13  (via drill 0.35)
  Top 0.305: U1.35 19.75,50.8 19.05,50.8 18.92,50.93 v16.51,50.93
  Bottom 0.305: v16.51,50.93 JP8.4
N$14  (via drill 0.35)
  Top 0.305: v17.78,49.78 17.85,49.71 U1.34
  Bottom 0.305: JP8.5 19.05,58.42 17.78,57.15 v17.78,49.78
N$16  (2 unrouted)
N$17  (1 unrouted)
N$18  (1 unrouted)
N$19  (2 unrouted)
RD  (via drill 0.35)
  Top 0.305: v68.58,12.7 71.12,10.16 JP1./RD | v54.61,26.67 58.42,30.48 58.42,38.1 59.69,39.37 v59.69,45.72 59.69,60.96 60.96,62.23 JP6.1
  Bottom 0.305: v68.58,12.7 62.23,12.7 60.96,13.97 58.42,13.97 55.88,16.51 55.88,22.9 54.61,24.17 v54.61,26.67 | IC4.1 52.07,39.37 53.34,40.64 55.88,40.64 57.15,41.91 57.15,43.18 v59.69,45.72 62.23,48.26 68.58,48.26 72.39,52.07 IC1.2
RD3V3  (via drill 0.35)
  Top 0.152: U1.6 3.11,48.26 5.08,48.26 6.35,46.99 6.35,44.45 7.62,43.18 13.97,43.18 v17.78,46.99
  Bottom 0.152: JP7.6 52.07,62.23 50.8,60.96 40.77,60.96 40.13,61.6 40.13,62.74 38.1,64.77 24.13,64.77 21.97,62.61 21.97,48.64 20.32,46.99 v17.78,46.99
SA15
  Top 0.305: IC5.3 63.5,26.67 64.77,27.94 64.77,34.29 66.04,35.56 66.04,38.1 67.31,39.37 67.31,42.55 JP9.3
SA16  (via drill 0.35)
  Top 0.305: IC5.2 v60.96,34.29 | v67.31,34.29 68.58,35.56 68.58,38.1 69.85,39.37 69.85,45.72 69.09,46.48 JP9.4
  Bottom 0.305: v60.96,34.29 v67.31,34.29
SLTSL
  Top 0.305: IC5.22 83.82,39.37 82.55,38.1 82.55,16.51 83.82,15.24 JP1./SLTSL
VCC  (via drill 0.35)
  Top 0.305: IC3.16 71.76,46.99 JP9.6 JP9.5
  Top 0.813: 39.37,60.96 39.37,45.72 38.1,44.45 | 39.37,60.96 39.37,66.04 41.27,67.94 C4.1 44.83,67.94 46.48,66.29 48.26,66.29 v49.91,67.94 | C5.1 56.77,38.1 58.42,39.75 IC5.32 v58.42,54.61 v58.42,67.94 | IC1.14 69.34,49.53 69.85,50.04 C3.1 69.85,66.34 73.81,66.34 v75.41,67.94 | IC2.16 92.2,46.99 92.84,47.62 C1.1 | v87.48,67.94 85.87,66.34 83.01,66.34 C2.1 81.41,48.77 79.63,46.99 IC3.16 | JP3.4 39.37,60.96 | JP2.4 38.1,44.45 | 38.1,44.45 39.37,43.18 39.37,40.64 40.64,39.37 IC4.20
  Bottom 0.813: JP1.+5V1 27.94,8.2 28.17,8.42 28.17,6.58 JP1.+5V1 | 30.48,10.16 30.48,13.97 31.75,15.24 C6.1 38.1,15.24 43.18,20.32 43.18,39.37 IC4.20 | 30.48,10.16 JP1.+5V2 30.25,6.58 30.25,8.42 | JP1.+5V1 27.94,10.16 30.48,10.16 | JP6.4 v58.42,54.61 | v49.91,67.94 v58.42,67.94 C3.1 | v75.41,67.94 C2.1 | v87.48,67.94 C1.1 | IC5.32 IC5.31
WAIT  (via drill 0.35)
  Top 0.305: v95.25,63.5 99.06,63.5 100.71,61.85 100.71,43.82 97.79,40.89 97.79,24.13 97.05,23.39 94.01,23.39 92.71,22.1 92.71,17.78 88.9,13.97 v88.9,14.09
  Bottom 0.305: JP1./WAIT v78.74,11.43 81.28,11.43 82.55,12.7 86.59,12.7 88.01,14.12 88.87,14.12 v88.9,14.09 | IC1.8 68.58,63.5 v95.25,63.5
WR  (via drill 0.35)
  Top 0.305: v71.12,11.43 73.66,13.97 v80.01,13.97 | v90.17,20.32 90.17,34.29 92.71,36.83 92.71,41.91 93.98,43.18 95.25,43.18 v96.52,44.45
  Bottom 0.305: JP1./WR v71.12,11.43 | v80.01,13.97 81.28,13.97 82.55,15.24 85.73,15.24 90.17,19.68 v90.17,20.32 | v96.52,44.45 78.74,44.45 76.2,46.99 76.2,48.26 IC1.1

### Text on the board
Top: v1.1 / 2020 | MSX-IoT